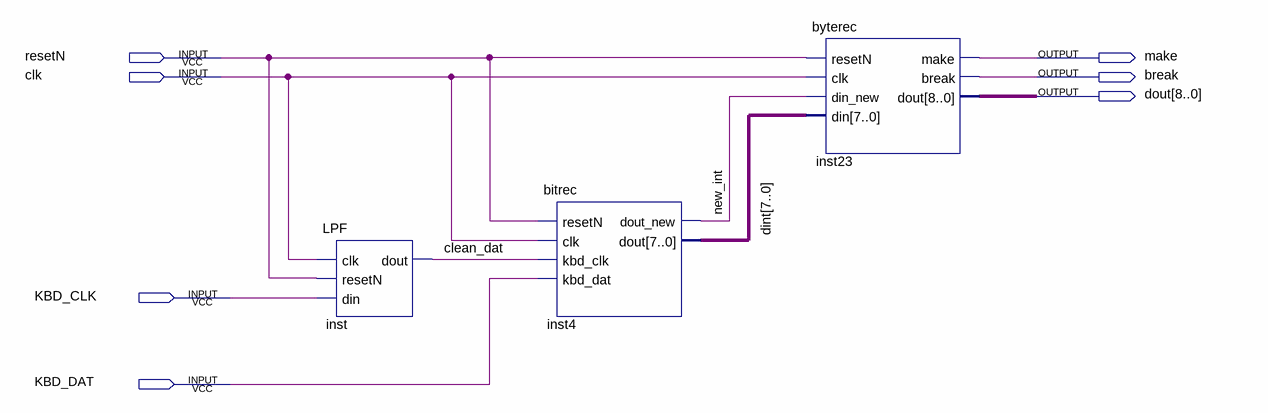
[diagram p0: schematic sheet]
// Quartus schematic kbd.bdf as structural Verilog: 3 symbols, 7 pins
module kbd (
  input  resetN,
  input  clk,
  input  KBD_CLK,
  input  KBD_DAT,
  output make,
  output \break ,
  output [8:0] dout
);

  wire clean_dat, new_int;
  wire [7:0] dint;

  LPF inst (.clk(clk), .resetN(resetN), .din(KBD_CLK), .dout(clean_dat));
  bitrec inst4 (.resetN(resetN), .clk(clk), .kbd_clk(clean_dat), .kbd_dat(KBD_DAT), .dout_new(new_int), .dout(dint));
  byterec inst23 (
    .resetN(resetN), .clk(clk), .din_new(new_int), .din(dint), .make(make), .\break (\break ), .dout(dout));
endmodule
